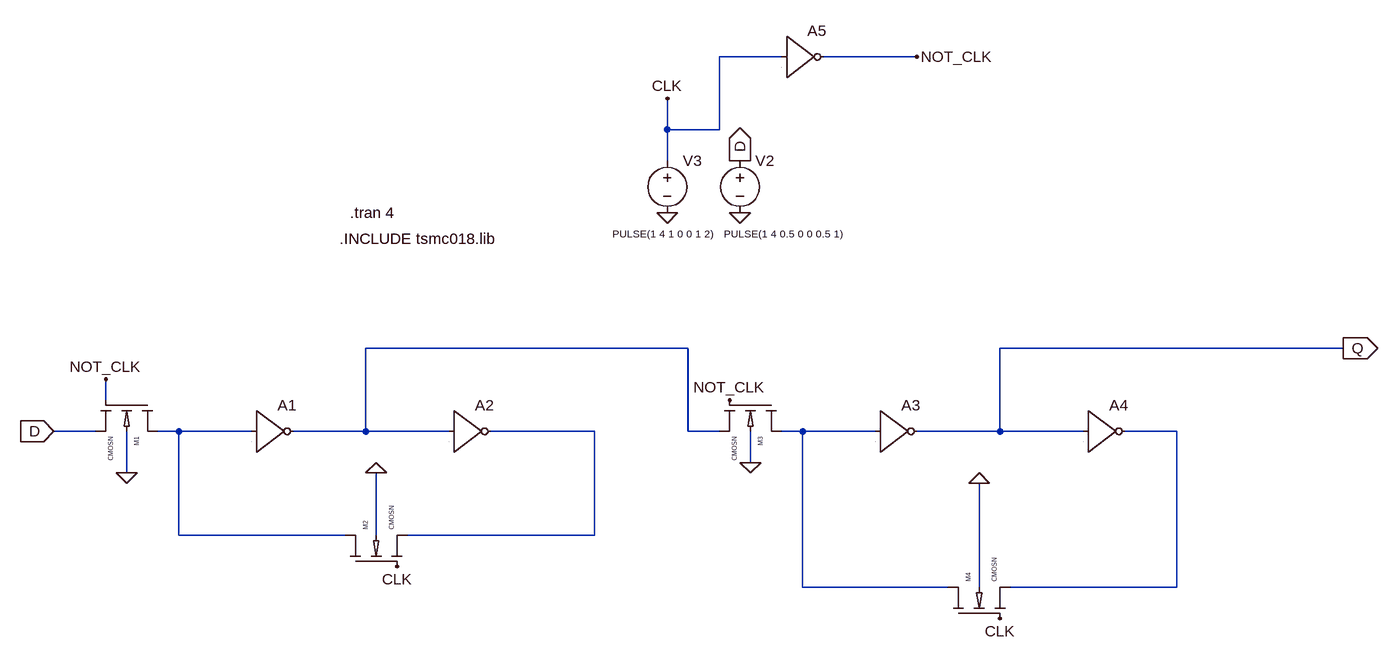
[diagram p0: schematic D-Flip-Flop.asc]
D-Flip-Flop.asc, the LTspice schematic file:
Version 4
SHEET 1 1036 680
WIRE 96 -432 0 -432
WIRE 304 -432 160 -432
WIRE -80 -320 -80 -368
WIRE 0 -320 0 -432
WIRE 0 -320 -80 -320
WIRE -80 -272 -80 -320
WIRE -48 16 -544 16
WIRE 960 16 432 16
WIRE -944 96 -944 64
WIRE -960 144 -1024 144
WIRE -832 144 -864 144
WIRE -720 144 -832 144
WIRE -544 144 -544 16
WIRE -544 144 -656 144
WIRE -416 144 -544 144
WIRE -192 144 -352 144
WIRE -48 144 -48 16
WIRE 0 144 -48 144
WIRE 128 144 96 144
WIRE 240 144 128 144
WIRE 432 144 432 16
WIRE 432 144 304 144
WIRE 560 144 432 144
WIRE 704 144 624 144
WIRE 48 192 48 144
WIRE -912 208 -912 144
WIRE -832 304 -832 144
WIRE -576 304 -832 304
WIRE -528 304 -528 208
WIRE -192 304 -192 144
WIRE -192 304 -480 304
WIRE 128 384 128 144
WIRE 352 384 128 384
WIRE 400 384 400 224
WIRE 704 384 704 144
WIRE 704 384 448 384
FLAG -912 208 0
FLAG -944 64 NOT_CLK
FLAG -1024 144 D
IOPIN -1024 144 In
FLAG -528 208 0
FLAG -496 352 CLK
FLAG 48 192 0
FLAG 16 96 NOT_CLK
FLAG 432 432 CLK
FLAG 32 -192 0
FLAG -80 -192 0
FLAG 32 -272 D
IOPIN 32 -272 Out
FLAG -80 -368 CLK
FLAG 304 -432 NOT_CLK
FLAG 960 16 Q
IOPIN 960 16 Out
FLAG 400 224 0
SYMBOL Ncmos -864 96 R90
SYMATTR InstName M1
SYMBOL Ncmos -576 352 R270
SYMATTR InstName M2
SYMBOL Ncmos 96 96 R90
SYMATTR InstName M3
SYMBOL Ncmos 352 432 R270
SYMATTR InstName M4
SYMBOL voltage 32 -288 R0
WINDOW 3 -25 128 Left 1
WINDOW 123 0 0 Left 0
WINDOW 39 0 0 Left 0
SYMATTR Value PULSE(1 4 0.5 0 0 0.5 1)
SYMATTR InstName V2
SYMBOL voltage -80 -288 R0
WINDOW 3 69 128 Right 1
WINDOW 123 0 0 Left 0
WINDOW 39 0 0 Left 0
SYMATTR Value PULSE(1 4 1 0 0 1 2)
SYMATTR InstName V3
SYMBOL Digital\\inv -720 80 R0
SYMATTR InstName A1
SYMBOL Digital\\inv -416 80 R0
SYMATTR InstName A2
SYMBOL Digital\\inv 240 80 R0
SYMATTR InstName A3
SYMBOL Digital\\inv 560 80 R0
SYMATTR InstName A4
SYMBOL Digital\\inv 96 -496 R0
SYMATTR InstName A5
TEXT -568 -192 Left 2 !.tran 4
TEXT -584 -152 Left 2 !.INCLUDE tsmc018.lib

The netlist it stands for:
* D-Flip-Flop.asc
M1 N002 NOT_CLK D 0 CMOSN
M2 N002 CLK N003 0 CMOSN
M3 N004 NOT_CLK N001 0 CMOSN
M4 N004 CLK N005 0 CMOSN
V2 D 0 PULSE(1 4 0.5 0 0 0.5 1)
V3 CLK 0 PULSE(1 4 1 0 0 1 2)
A1 N002 0 0 0 0 N001 0 0 BUF
A2 N001 0 0 0 0 N003 0 0 BUF
A3 N004 0 0 0 0 Q 0 0 BUF
A4 Q 0 0 0 0 N005 0 0 BUF
A5 CLK 0 0 0 0 NOT_CLK 0 0 BUF
.model NMOS NMOS
.model PMOS PMOS
.lib standard.mos
.tran 4
.INCLUDE tsmc018.lib
.lib tsmc018.lib
.backanno
.end